# EAGLE design PSX-PS2 (EAGLE 9.6.2)
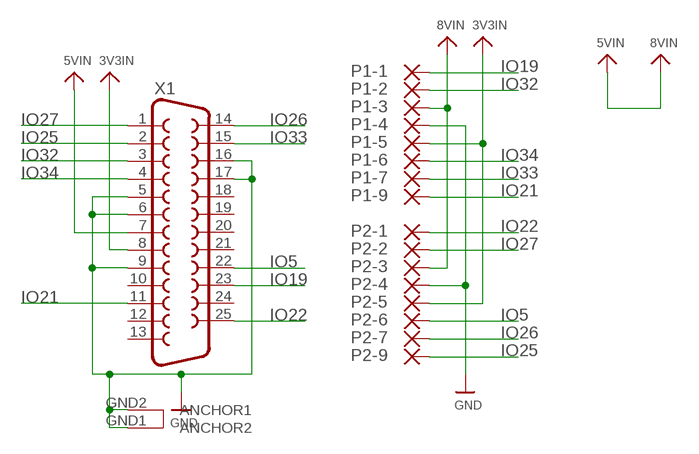
[diagram p0: schematic, sheet 1]

## Parts
P1-1  SMD5  [SMD2,54-5,08]
P1-2  SMD5  [SMD2,54-5,08]
P1-3  SMD5  [SMD2,54-5,08]
P1-4  SMD5  [SMD2,54-5,08]
P1-5  SMD5  [SMD2,54-5,08]
P1-6  SMD5  [SMD2,54-5,08]
P1-7  SMD5  [SMD2,54-5,08]
P1-9  SMD5  [SMD2,54-5,08]
P2-1  SMD5  [SMD2,54-5,08]
P2-2  SMD5  [SMD2,54-5,08]
P2-3  SMD5  [SMD2,54-5,08]
P2-4  SMD5  [SMD2,54-5,08]
P2-5  SMD5  [SMD2,54-5,08]
P2-6  SMD5  [SMD2,54-5,08]
P2-7  SMD5  [SMD2,54-5,08]
P2-9  SMD5  [SMD2,54-5,08]
X1  DB25_FEMALEHP  [F25HP]

## Nets
3V3IN: P1-5.1(P) P2-5.1(P) X1.8
GND: P1-4.1(P) P2-4.1(P) X1.5 X1.6 X1.9 X1.16 X1.17 X1.GND1(ANCHOR2) X1.GND2(ANCHOR1)
IO5: P2-6.1(P) X1.22
IO19: P1-1.1(P) X1.23
IO21: P1-9.1(P) X1.11
IO22: P2-1.1(P) X1.25
IO25: P2-9.1(P) X1.2
IO26: P2-7.1(P) X1.14
IO27: P2-2.1(P) X1.1
IO32: P1-2.1(P) X1.3
IO33: P1-7.1(P) X1.15
IO34: P1-6.1(P) X1.4
VIN: P1-3.1(P) P2-3.1(P) X1.7 ; supply symbol labelled 5VIN, 8VIN
Unconnected: X1.10 X1.12 X1.13 X1.18 X1.19 X1.20 X1.21 X1.24

## Library data of the parts
P1-1-P1-7 P1-9 P2-1-P2-7 P2-9 = wirepad:SMD5: SMD PAD
X1 = SparkFun-Retired:DB25_FEMALE: 25 Pin male connector. PCB edge mount for regular PCB thicknesses. This connector will connect directly to the back of a PC parallel port or through a normal DB25 extension cable (M/F). SKU: PRT-08287

## Board
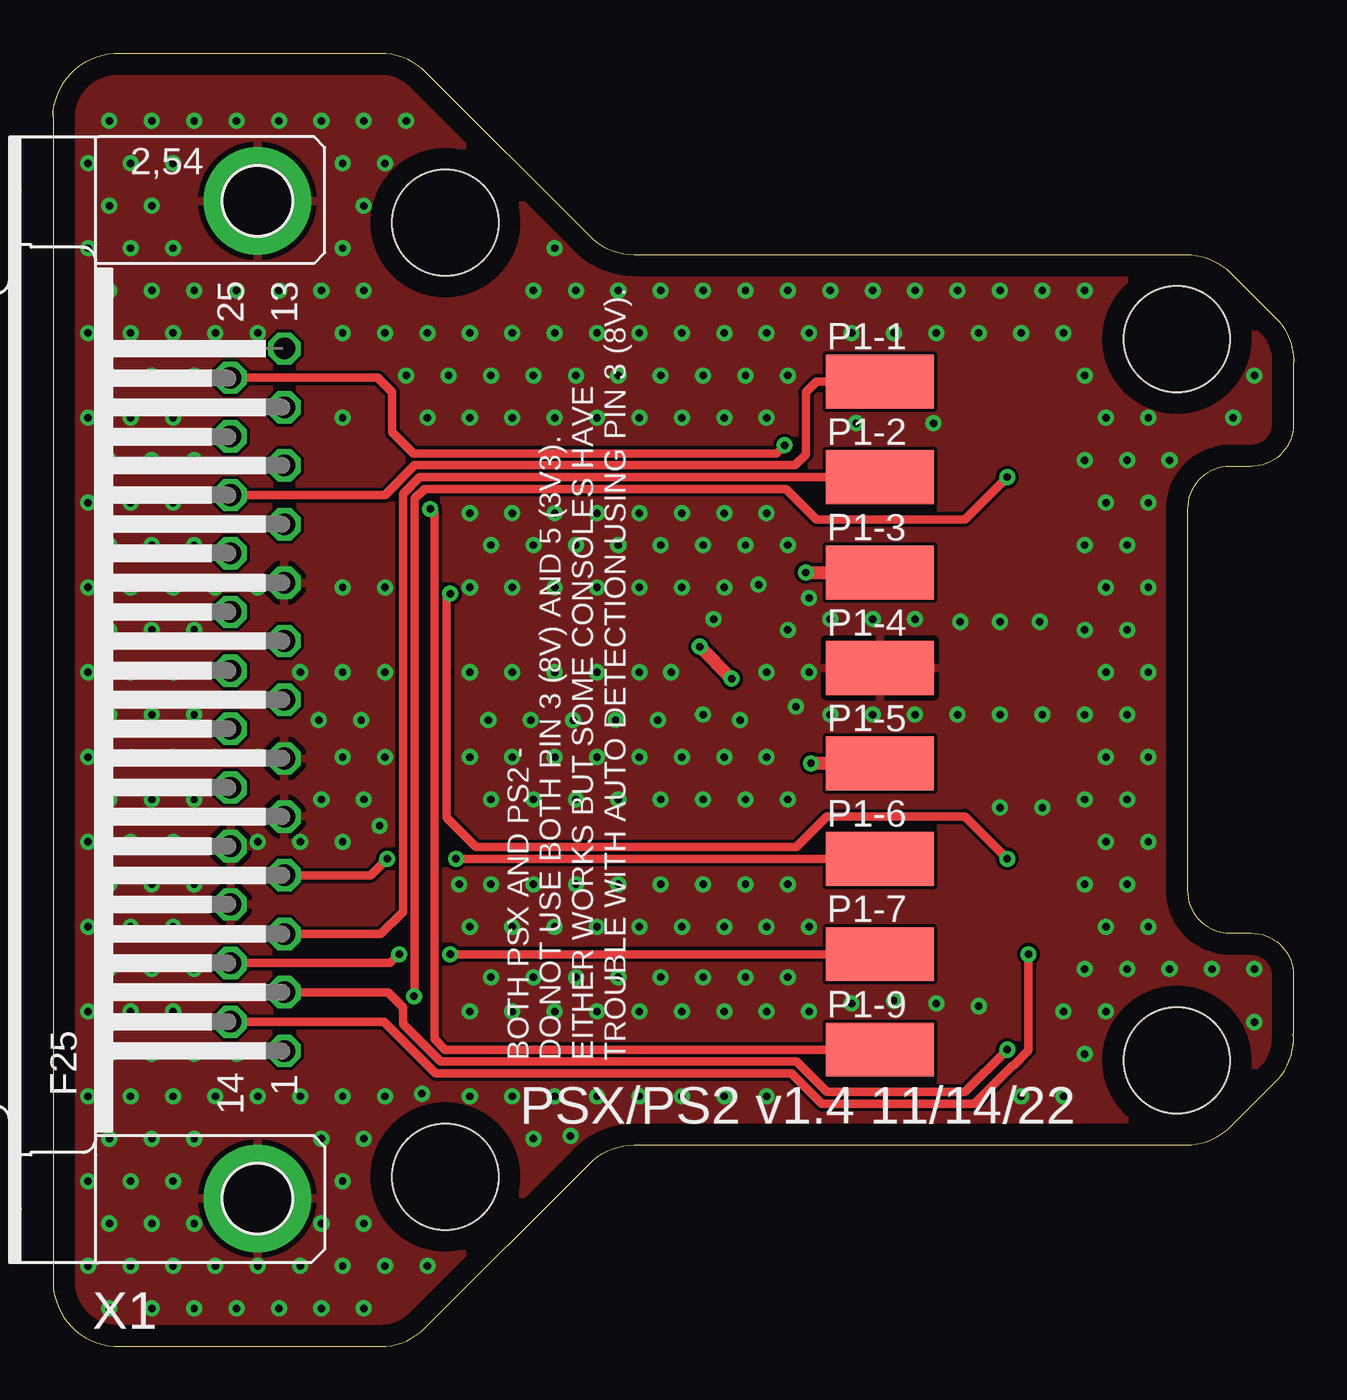
[diagram p1: board, top side]
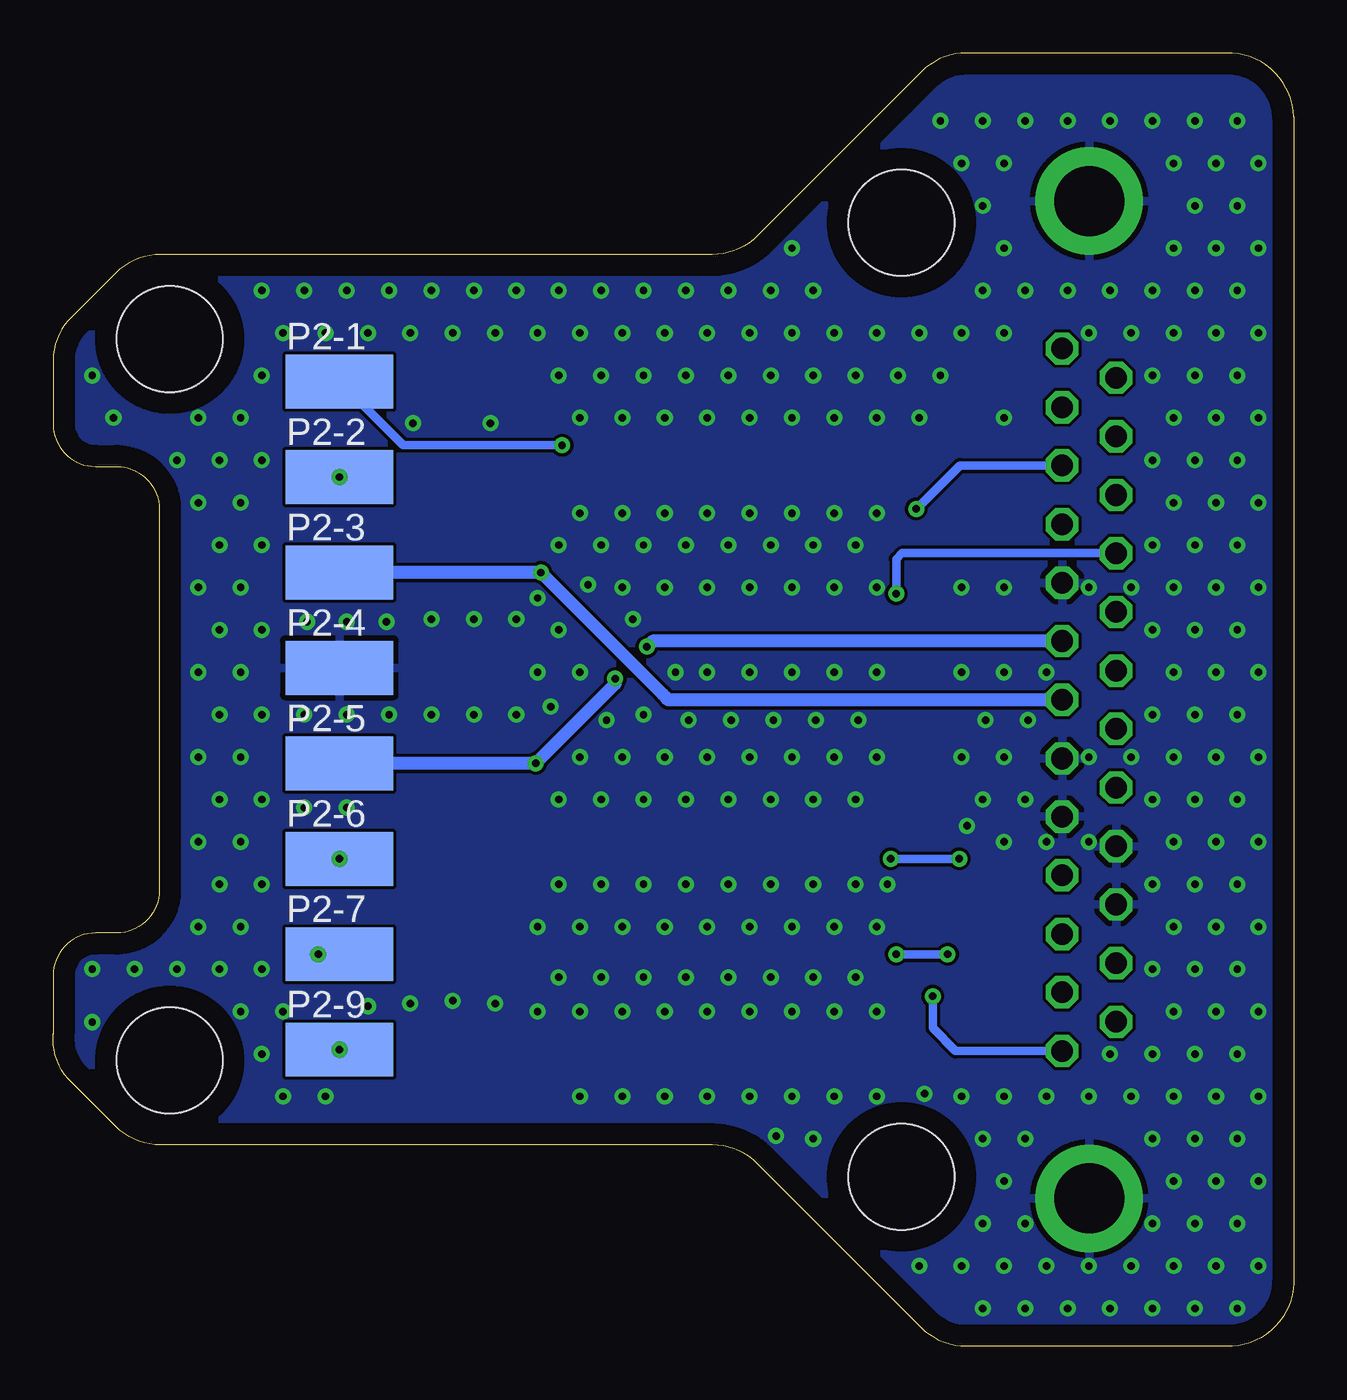
[diagram p2: board, bottom side, seen from below]

Size 58.51 x 61 mm. Coordinates in mm from the lower left corner, seen from the top.
Outline: 0,58 0,3 arc90 3.17,0 15.43,0 arc45 17.55,0.88 25.29,8.62 arc-45 27.41,9.5 53.43,9.5 arc45 55.55,10.38 57.79,12.62 arc45 58.5,14.74 58.5,17.5 arc90 56.5,19.5 55.5,19.5 arc-90 53.5,21.5 53.5,39.5 arc-90 55.5,41.5 56.5,41.5 arc90 58.5,43.5 58.5,46.26 arc45 57.79,48.38 55.55,50.62 arc45 53.43,51.5 27.41,51.5 arc-45 25.29,52.38 17.55,60.12 arc45 15.43,61 3.17,61 arc90 0,58
Copper layers (1*16): Top 0.035mm / dielectric 1.5mm / Bottom 0.035mm
Design rules "default": minimum track width 6mil, minimum drill 0.35mm, track to track 6mil, track to pad 6mil, pad to pad 6mil, via to via 6mil, smd to smd 6mil, copper to edge 40mil, drill to drill 6mil, minimum pad ring 10mil, minimum via ring 8mil, stop-mask expansion 4mil, vias tented up to drill 0.5mm, thermal gap 10mil
Holes 5 mm at 53,13.5 53,47.5 18.5,53 18.5,8

### Footprints (pad centres in the part's own frame; a part is rotated, then mirrored left to right if it is on the bottom)
SMD2,54-5,08 = smd 2.54 x 5.08: 1 0,0
F25HP = drill 1.016 octagon: 1 -16.561,-1.27; 2 -13.792,-1.27; 3 -11.049,-1.27; 4 -8.28,-1.27; 5 -5.512,-1.27; 6 -2.769,-1.27; 7 0,-1.27; 8 2.769,-1.27; 9 5.512,-1.27; 10 8.28,-1.27; 11 11.049,-1.27; 12 13.792,-1.27; 13 16.561,-1.27; 14 -15.189,1.27; 15 -12.421,1.27; 16 -9.652,1.27; 17 -6.909,1.27; 18 -4.14,1.27; 19 -1.372,1.27; 20 1.372,1.27; 21 4.14,1.27; 22 6.909,1.27; 23 9.652,1.27; 24 12.421,1.27; 25 15.189,1.27 | drill 3.302 pad 5.08: GND1 -23.52,0; GND2 23.52,0

### Placement (x,y rotation side)
P1-1  39,45.5 270 top
P1-2  39,41 270 top
P1-3  39,36.5 270 top
P1-4  39,32 270 top
P1-5  39,27.5 270 top
P1-6  39,23 270 top
P1-7  39,18.5 270 top
P1-9  39,14 270 top
P2-1  45,45.5 270 bottom
P2-2  45,41 270 bottom
P2-3  45,36.5 270 bottom
P2-4  45,32 270 bottom
P2-5  45,27.5 270 bottom
P2-6  45,23 270 bottom
P2-7  45,18.5 270 bottom
P2-9  45,14 270 bottom
X1  9.64,30.5 90 top

### Tracks (layer width: path | path; a pad name or v marks a point on that pad's centre or on a via)
3V3IN  (via drill 0.35)
  Top 0.61: v30.5,33 v32,31.5 | P1-5.1 v35.75,27.5
  Bottom 0.61: v32,31.5 32,31.25 v35.75,27.5 P2-5.1 | X1.8 30.23,33.27 v30.5,33
GND  (via drill 0.35)
  other vias: 2.66,1.8 1.66,3.8 2.66,5.8 1.66,7.8 2.66,9.8 1.66,11.8 2.66,13.8 1.66,15.8 2.66,17.8 1.66,19.8 2.66,21.8 1.66,23.8 2.66,25.8 1.66,27.8 2.66,29.8 1.66,31.8 2.66,33.8 1.66,35.8 2.66,37.8 1.66,39.8 2.66,41.8 1.66,43.8 2.66,45.8 1.66,47.8 2.66,49.8 1.66,51.8 2.66,53.8 1.66,55.8 2.66,57.8 4.66,1.8 3.66,3.8 4.66,5.8 3.66,7.8 4.66,9.8 3.66,11.8 4.66,13.8 3.66,15.8 4.66,17.8 3.66,19.8 4.66,21.8 3.66,23.8 4.66,25.8 3.66,27.8 4.66,29.8 3.66,31.8 4.66,33.8 3.66,35.8 4.66,37.8 3.66,39.8 4.66,41.8 3.66,43.8 4.66,45.8 3.66,47.8 4.66,49.8 3.66,51.8 4.66,53.8 3.66,55.8 4.66,57.8 6.66,1.8 5.66,3.8 6.66,5.8 5.66,7.8 6.66,9.8 5.66,11.8 6.66,13.8 5.66,15.8 6.66,17.8 5.66,19.8 6.66,21.8 5.66,23.8 6.66,25.8 5.66,27.8 6.66,29.8 5.66,31.8 6.66,33.8 5.66,35.8 6.66,37.8 5.66,39.8 6.66,41.8 5.66,43.8 6.66,45.8 5.66,47.8 6.66,49.8 5.66,51.8 5.66,55.8 6.66,57.8 8.66,1.8 7.66,3.8 7.66,11.8 8.66,13.8 7.66,27.8 7.66,35.8 7.66,47.8 8.66,49.8 8.66,57.8 10.66,1.8 9.66,3.8 9.66,11.8 9.66,23.8 9.66,27.8 9.66,35.8 9.66,47.8 10.66,49.8 10.66,57.8 12.66,1.8 11.66,3.8 12.66,5.8 12.66,9.8 11.66,11.8 11.66,23.8 12.66,25.8 12.53,29.54 11.66,31.8 12.66,49.8 12.66,57.8 14.66,1.8 13.66,3.8 14.66,5.8 13.66,7.8 14.66,9.8 13.66,11.8 13.66,23.8 14.66,25.8 13.66,27.8 14.53,29.54 13.66,31.8 13.66,35.8 13.66,43.8 13.66,47.8 14.66,49.8 13.66,51.8 14.66,53.8 13.66,55.8 14.66,57.8 15.66,3.8 15.66,11.8 15.4,24.56 15.66,27.8 15.66,31.8 15.66,35.8 16.66,45.8 15.66,47.8 15.66,55.8 16.66,57.8 17.66,3.8 17.4,11.92 19.16,21.8 17.66,43.8 18.66,45.8 17.66,47.8 19.66,11.8 19.66,15.8 20.66,17.42 19.66,19.8 20.66,21.8 20.66,25.8 19.66,27.8 20.53,29.54 19.66,31.8 19.66,35.8 20.66,37.8 19.66,39.3 19.66,43.8 20.66,45.8 19.66,47.8 22.66,9.8 21.66,11.8 21.66,15.8 22.66,17.42 21.66,19.8 22.66,21.8 22.66,25.8 21.66,27.8 22.53,29.54 21.66,31.8 21.66,35.8 22.66,37.8 21.66,39.3 21.66,43.8 22.66,45.8 21.66,47.8 22.66,49.8 24.4,9.92 23.66,11.8 23.66,15.8 24.66,17.42 23.66,19.8 24.66,21.8 24.66,25.8 23.66,27.8 24.53,29.54 23.66,31.8 23.66,35.8 24.66,37.8 23.66,39.3 23.66,43.8 24.66,45.8 23.66,47.8 24.66,49.8 23.66,51.8 25.66,11.8 25.66,15.8 26.66,17.42 25.66,19.8 26.66,21.8 26.66,25.8 25.66,27.8 26.53,29.54 25.66,31.8 25.66,35.8 26.66,37.8 25.66,39.3 25.66,43.8 26.66,45.8 25.66,47.8 26.66,49.8 27.66,11.8 27.66,15.8 28.66,17.42 27.66,19.8 28.66,21.8 28.66,25.8 27.66,27.8 28.53,29.54 27.66,31.8 27.66,35.8 28.66,37.8 27.66,39.3 27.66,43.8 28.66,45.8 27.66,47.8 28.66,49.8 29.66,11.8 29.66,15.8 30.66,17.42 29.66,19.8 30.66,21.8 30.66,25.8 29.66,27.8 30.66,29.8 29.15,31.8 31.16,34.3 29.66,35.8 30.66,37.8 29.66,39.3 29.66,43.8 30.66,45.8 29.66,47.8 30.66,49.8 31.66,11.8 31.66,15.8 32.66,17.42 31.66,19.8 32.66,21.8 32.66,25.8 31.66,27.8 32.4,29.54 31.66,35.8 32.66,37.8 31.66,39.3 31.66,43.8 32.66,45.8 31.66,47.8 32.66,49.8 33.66,11.8 33.66,15.8 34.66,17.42 33.66,19.8 34.66,21.8 34.66,25.8 33.66,27.8 35.04,30.18 33.66,31.8 34.66,33.8 33.28,35.92 34.66,37.8 33.66,39.3 33.66,43.8 34.66,45.8 33.66,47.8 34.66,49.8 35.66,15.8 35.66,19.8 36.66,29.8 35.66,31.8 36.66,34.3 35.66,35.3 35.66,47.8 36.66,49.8 37.66,16.18 38.66,29.8 38.66,34.3 37.66,47.8 38.66,49.8 39.66,16.3 40.66,29.8 40.66,34.3 39.66,47.8 40.66,49.8 41.66,16.18 42.66,29.8 42.78,34.18 41.53,43.54 41.66,47.8 42.66,49.8 43.66,16.05 44.66,25.42 44.66,29.8 44.66,34.18 43.66,47.8 44.66,49.8 45.66,11.8 46.66,25.42 46.66,29.8 46.53,34.18 45.66,47.8 46.66,49.8 47.66,11.8 48.66,13.8 47.66,15.8 48.66,17.8 48.66,21.8 48.66,25.8 48.66,29.8 48.66,33.8 48.66,37.8 48.66,41.8 37.88,43.54 48.66,45.8 47.66,47.8 48.66,49.8 49.66,15.8 50.66,17.8 49.66,19.8 50.66,21.8 49.66,23.8 50.66,25.8 49.66,27.8 50.66,29.8 49.66,31.8 50.66,33.8 49.66,35.8 50.66,37.8 49.66,39.8 50.66,41.8 49.66,43.8 52.66,17.8 51.66,19.8 51.66,23.8 51.66,27.8 51.66,31.8 51.66,35.8 51.66,39.8 52.66,41.8 51.66,43.8 54.66,17.8 56.66,15.3 56.66,17.8 55.66,43.8 56.66,45.8
  pour Top: 0,0 0,61 28.67,61 28.67,51.5 59.17,51.5 59.17,9.5 28.17,9.5 28.17,0
  pour Bottom: 0,0 0,61 28.67,61 28.67,51.5 59.17,51.5 59.17,9.5 28.17,9.5 28.17,0
IO5  (via drill 0.35)
  Top 0.406: P2-6.1 43,25 36.5,25 35.06,23.56 19.94,23.56 18.56,24.94 18.56,35.33 v18.73,35.5
  Bottom 0.406: X1.22 18.47,37.41 18.73,37.15 v18.73,35.5
  other vias: 45,23
IO19
  Top 0.406: P1-1.1 36,45.5 35.5,45 35.5,42.06 35,41.56 17.06,41.56 15.65,40.15 X1.23
IO21  (via drill 0.35)
  Top 0.406: P1-9.1 18.5,14 18,14.5 18,39.29 v17.79,39.5
  Bottom 0.406: X1.11 15.74,41.55 v17.79,39.5
IO22  (via drill 0.35)
  Top 0.406: v34.5,42.5 34.12,42.12 17,42.12 16,43.12 16,45 15.31,45.69 X1.25
  Bottom 0.406: P2-1.1 42,42.5 v34.5,42.5
IO25  (via drill 0.35)
  Top 0.406: P2-9.1 43,12 36.5,12 35.06,13.44 18.27,13.44 16.5,15.21 16.5,16 15.79,16.71 X1.2
  other vias: 45,14
IO26  (via drill 0.35)
  Top 0.406: v46,18.5 46,13.96 45.3,13.27 45.27,13.27 43.44,11.44 36.27,11.44 34.83,12.88 18.04,12.88 15.61,15.31 X1.14
  Bottom 0.406: P2-7.1 v46,18.5
IO27  (via drill 0.35)
  Top 0.406: P2-2.1 43,39 36,39 34.56,40.44 17.52,40.44 17.06,39.98 17.06,16.56 v17.02,16.52
  Bottom 0.406: v17.02,16.52 17.02,15.02 15.94,13.94 X1.1
  other vias: 45,41
IO32
  Top 0.406: P1-2.1 17.29,41 16.5,40.21 16.5,20.5 15.45,19.45 X1.3
IO33  (via drill 0.35)
  Top 0.406: P1-7.1 v18.73,18.5 | X1.15 15.9,18.08 v16.32,18.5
  Bottom 0.406: v18.73,18.5 v16.32,18.5
IO34  (via drill 0.35)
  Top 0.406: P1-6.1 v19,23 | X1.4 14.99,22.22 v15.77,23
  Bottom 0.406: v19,23 v15.77,23
VIN  (via drill 0.35)
  Top 0.61: v35.5,36.5 P1-3.1
  Bottom 0.61: P2-3.1 v35.5,36.5 29.75,30.75 29.63,30.63 29.5,30.5 X1.7

### Text on the board
tPlace: PSX/PS2 v1.4 11/14/22
tNames: BOTH PSX AND PS2 - / DO NOT USE BOTH PIN 3 (8V) AND 5 (3V3). / EITHER WORKS BUT SOME CONSOLES HAVE / TROUBLE WITH AUTO DETECTION USING PIN 3 (8V).